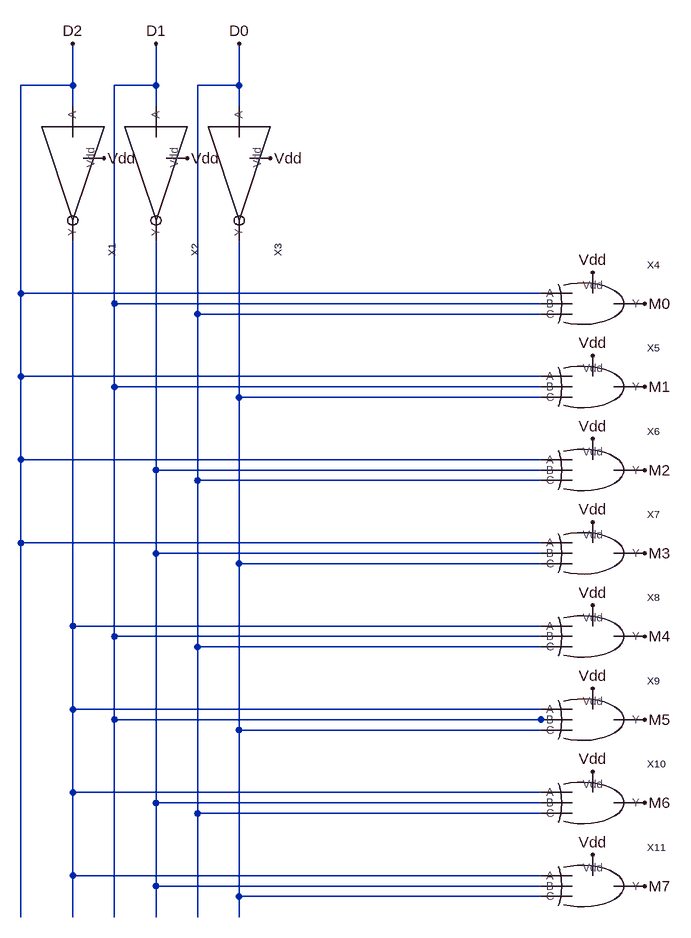
[diagram p0: schematic decoder3x8.asc]
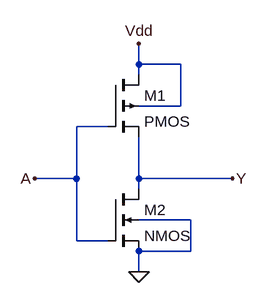
[diagram p1: sub-circuit not1.asc]
decoder3x8.asc, the LTspice schematic file:
Version 4
SHEET 1 980 1228
WIRE 48 -64 48 -128
WIRE 48 -64 -32 -64
WIRE 176 -64 176 -128
WIRE 176 -64 112 -64
WIRE 304 -64 304 -128
WIRE 304 -64 240 -64
WIRE 48 -32 48 -64
WIRE 176 -32 176 -64
WIRE 304 -32 304 -64
WIRE -32 256 -32 -64
WIRE 768 256 -32 256
WIRE 112 272 112 -64
WIRE 768 272 112 272
WIRE 240 288 240 -64
WIRE 768 288 240 288
WIRE -32 384 -32 256
WIRE 768 384 -32 384
WIRE 112 400 112 272
WIRE 768 400 112 400
WIRE 304 416 304 176
WIRE 768 416 304 416
WIRE -32 512 -32 384
WIRE 768 512 -32 512
WIRE 176 528 176 176
WIRE 768 528 176 528
WIRE 240 544 240 288
WIRE 768 544 240 544
WIRE -32 640 -32 512
WIRE 768 640 -32 640
WIRE 176 656 176 528
WIRE 768 656 176 656
WIRE 304 672 304 416
WIRE 768 672 304 672
WIRE 48 768 48 176
WIRE 768 768 48 768
WIRE 112 784 112 400
WIRE 768 784 112 784
WIRE 240 800 240 544
WIRE 768 800 240 800
WIRE 48 896 48 768
WIRE 768 896 48 896
WIRE 112 912 112 784
WIRE 768 912 112 912
WIRE 784 912 768 912
WIRE 304 928 304 672
WIRE 768 928 304 928
WIRE 48 1024 48 896
WIRE 768 1024 48 1024
WIRE 176 1040 176 656
WIRE 768 1040 176 1040
WIRE 240 1056 240 800
WIRE 768 1056 240 1056
WIRE 48 1152 48 1024
WIRE 768 1152 48 1152
WIRE 176 1168 176 1040
WIRE 768 1168 176 1168
WIRE 304 1184 304 928
WIRE 768 1184 304 1184
WIRE -32 1216 -32 640
WIRE 48 1216 48 1152
WIRE 112 1216 112 912
WIRE 176 1216 176 1168
WIRE 240 1216 240 1056
WIRE 304 1216 304 1184
FLAG 48 -128 D2
FLAG 176 -128 D1
FLAG 304 -128 D0
FLAG 352 48 Vdd
FLAG 224 48 Vdd
FLAG 96 48 Vdd
FLAG 848 224 Vdd
FLAG 848 352 Vdd
FLAG 848 480 Vdd
FLAG 848 608 Vdd
FLAG 848 736 Vdd
FLAG 848 864 Vdd
FLAG 848 992 Vdd
FLAG 848 1120 Vdd
FLAG 928 272 M0
FLAG 928 400 M1
FLAG 928 528 M2
FLAG 928 656 M3
FLAG 928 784 M4
FLAG 928 912 M5
FLAG 928 1040 M6
FLAG 928 1168 M7
SYMBOL NOT1 48 48 R90
SYMATTR InstName X1
SYMBOL NOT1 176 48 R90
SYMATTR InstName X2
SYMBOL NOT1 304 48 R90
SYMATTR InstName X3
SYMBOL NOR3 816 272 R0
SYMATTR InstName X4
SYMBOL NOR3 816 400 R0
SYMATTR InstName X5
SYMBOL NOR3 816 528 R0
SYMATTR InstName X6
SYMBOL NOR3 816 656 R0
SYMATTR InstName X7
SYMBOL NOR3 816 784 R0
SYMATTR InstName X8
SYMBOL NOR3 816 912 R0
SYMATTR InstName X9
SYMBOL NOR3 816 1040 R0
SYMATTR InstName X10
SYMBOL NOR3 816 1168 R0
SYMATTR InstName X11

not1.asc, the sub-circuit schematic file:
Version 4
SHEET 1 880 680
WIRE 224 16 224 -16
WIRE 288 16 224 16
WIRE 224 32 224 16
WIRE 288 80 288 16
WIRE 288 80 224 80
WIRE 176 112 128 112
WIRE 128 192 128 112
WIRE 128 192 64 192
WIRE 224 192 224 128
WIRE 368 192 224 192
WIRE 224 208 224 192
WIRE 304 256 224 256
WIRE 128 288 128 192
WIRE 176 288 128 288
WIRE 304 304 304 256
WIRE 304 304 224 304
WIRE 224 336 224 304
FLAG 224 336 0
FLAG 224 -16 Vdd
FLAG 64 192 A
FLAG 368 192 Y
SYMBOL pmos4 176 32 R0
SYMATTR InstName M1
SYMBOL nmos4 176 208 R0
SYMATTR InstName M2

The netlist it stands for:
* decoder3x8.asc
XX1 D2 N003 Vdd not1
XX2 D1 N002 Vdd not1
XX3 D0 N001 Vdd not1
XX4 D2 D1 D0 M0 Vdd NOR3  ; pins A B C Y Vdd
XX5 D2 D1 N001 M1 Vdd NOR3  ; pins A B C Y Vdd
XX6 D2 N002 D0 M2 Vdd NOR3  ; pins A B C Y Vdd
XX7 D2 N002 N001 M3 Vdd NOR3  ; pins A B C Y Vdd
XX8 N003 D1 D0 M4 Vdd NOR3  ; pins A B C Y Vdd
XX9 N003 D1 N001 M5 Vdd NOR3  ; pins A B C Y Vdd
XX10 N003 N002 D0 M6 Vdd NOR3  ; pins A B C Y Vdd
XX11 N003 N002 N001 M7 Vdd NOR3  ; pins A B C Y Vdd

* block symbol definitions
.subckt not1 A Y Vdd
M1 Vdd A Y Vdd PMOS
M2 Y A 0 0 NMOS
.ends not1

.model NMOS NMOS
.model PMOS PMOS
.lib standard.mos
.backanno
.end